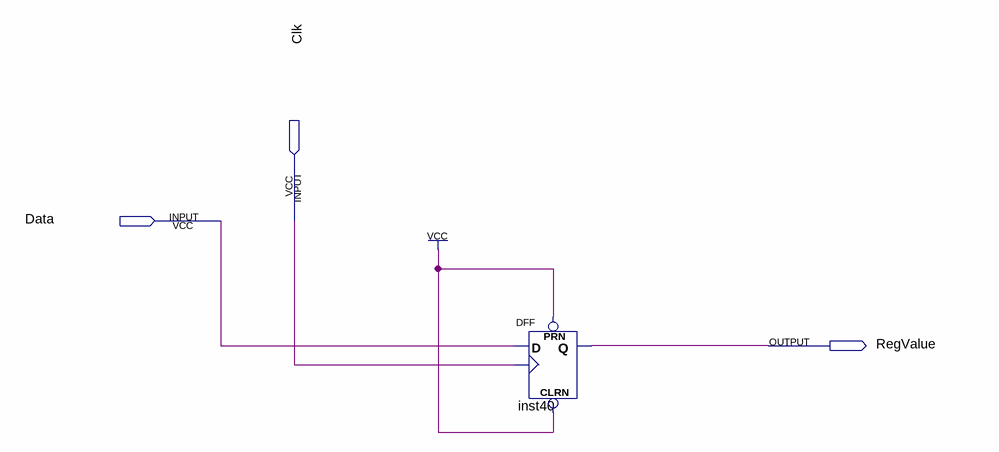
[diagram p0: schematic sheet]
// Quartus schematic Register_1bit.bdf as structural Verilog: 1 symbols, 3 pins
module Register_1bit (
  input  Data,
  input  Clk,
  output RegValue
);

  DFF inst40 (.CLRN(1'b1), .CLK(Clk), .D(Data), .PRN(1'b1), .Q(RegValue));
endmodule
